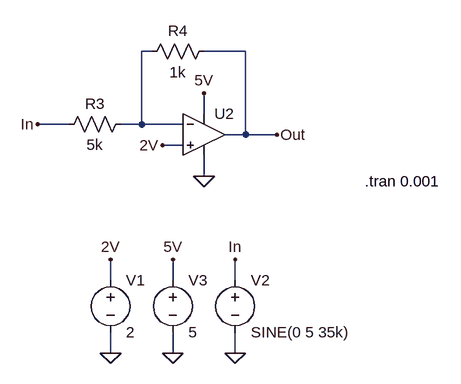
[diagram p0: schematic Volrage Shifter and Amplitude Limiter.asc]
Volrage Shifter and Amplitude Limiter.asc, the LTspice schematic file:
Version 4
SHEET 1 880 680
WIRE 16 16 0 16
WIRE 160 16 96 16
WIRE 96 112 96 80
WIRE -112 128 -160 128
WIRE 0 128 0 16
WIRE 0 128 -32 128
WIRE 64 128 0 128
WIRE 160 144 160 16
WIRE 160 144 128 144
WIRE 208 144 160 144
WIRE 64 160 32 160
WIRE 96 208 96 176
WIRE -48 368 -48 336
WIRE 48 368 48 336
WIRE 144 368 144 336
WIRE -48 480 -48 448
WIRE 48 480 48 448
WIRE 144 480 144 448
FLAG 144 480 0
FLAG 48 480 0
FLAG -48 480 0
FLAG -48 336 2V
FLAG 48 336 5V
FLAG 144 336 In
FLAG 96 208 0
FLAG 32 160 2V
FLAG 96 80 5V
FLAG -160 128 In
FLAG 208 144 Out
SYMBOL voltage -48 352 R0
WINDOW 123 0 0 Left 0
WINDOW 39 0 0 Left 0
SYMATTR InstName V1
SYMATTR Value 2
SYMBOL voltage 144 352 R0
WINDOW 123 0 0 Left 0
WINDOW 39 0 0 Left 0
SYMATTR InstName V2
SYMATTR Value SINE(0 5 35k)
SYMBOL voltage 48 352 R0
WINDOW 123 0 0 Left 0
WINDOW 39 0 0 Left 0
SYMATTR InstName V3
SYMATTR Value 5
SYMBOL OpAmps\\UniversalOpAmp2 96 144 R0
SYMATTR InstName U2
SYMATTR Value2 Avol=1Meg GBW=5Meg Slew=12Meg Vos=3m
SYMBOL res -16 112 R90
WINDOW 0 0 56 VBottom 2
WINDOW 3 32 56 VTop 2
SYMATTR InstName R3
SYMATTR Value 5k
SYMBOL res 112 0 R90
WINDOW 0 0 56 VBottom 2
WINDOW 3 32 56 VTop 2
SYMATTR InstName R4
SYMATTR Value 1k
TEXT 344 216 Left 2 !.tran 0.001

The netlist it stands for:
* Volrage Shifter and Amplitude Limiter.asc
V1 2V 0 2
V2 In 0 SINE(0 5 35k)
V3 5V 0 5
XU2 2V N001 5V 0 Out level2 Avol=1Meg GBW=5Meg Slew=12Meg Vos=3m Ilimit=25m Rail=0 Vos=0 En=0 Enk=0 In=0 Ink=0 Rin=500Meg  ; pins In+ In- V+ V- OUT
R3 N001 In 5k
R4 Out N001 1k
.tran 0.001
.lib UniversalOpAmp2.lib
.backanno
.end